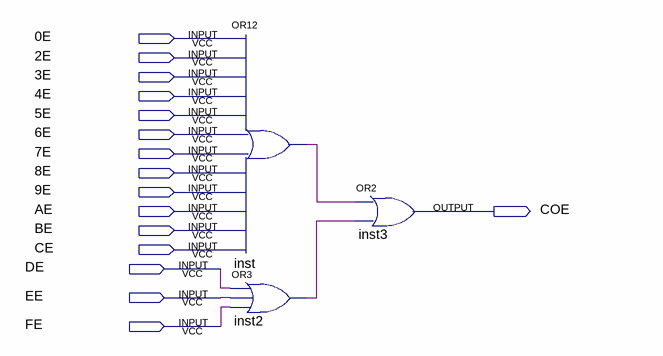
[diagram p0: schematic sheet]
// Quartus schematic COLUNA_E.bdf as structural Verilog: 3 symbols, 16 pins
module COLUNA_E (
  input  \0E ,
  input  \2E ,
  input  \3E ,
  input  \4E ,
  input  \5E ,
  input  \6E ,
  input  \7E ,
  input  \8E ,
  input  \9E ,
  input  AE,
  input  BE,
  input  CE,
  input  DE,
  input  EE,
  input  FE,
  output COE
);

  wire inst2_out, inst_out;

  or inst (inst_out, \0E , \2E , \3E , \4E , \5E , \6E , \7E , \8E , \9E , AE, BE, CE);
  or inst2 (inst2_out, DE, EE, FE);
  or inst3 (COE, inst_out, inst2_out);
endmodule
